# EAGLE design RCS_Metro_Telem_Board (EAGLE 8.7.1)
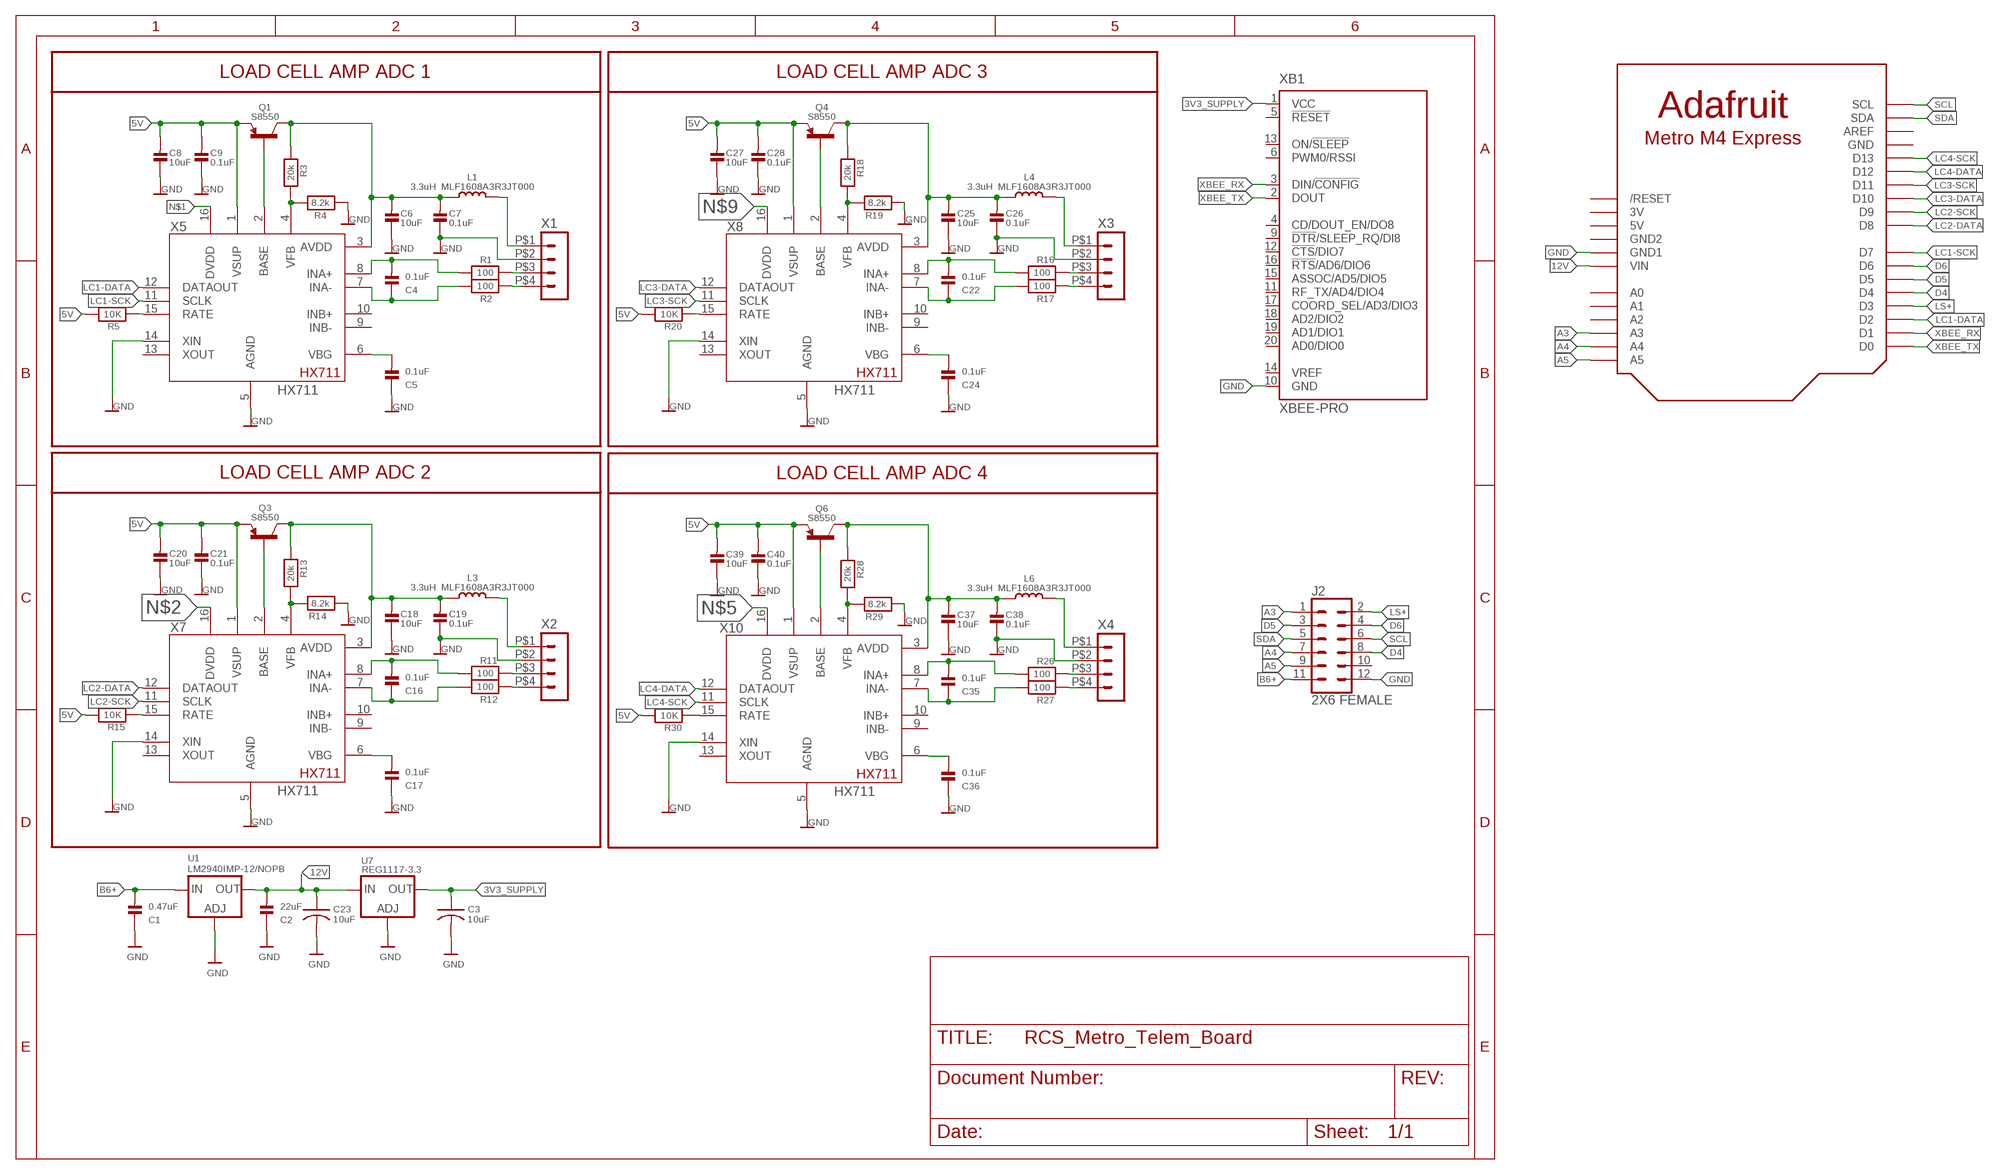
[diagram p0: schematic, sheet 1]

## Parts
C1  0.47uF  CAP_CERAMIC0603  [0603@1]
C2  22uF  CAP_CERAMIC0603  [0603@1]
C3  10uF  C-USC0603  [C0603]
C4  0.1uF  CAP_CERAMIC0603  [0603@1]
C5  0.1uF  CAP_CERAMIC0603  [0603@1]
C6  10uF  CAP_CERAMIC0603  [0603@1]
C7  0.1uF  CAP_CERAMIC0603  [0603@1]
C8  10uF  CAP_CERAMIC0603  [0603@1]
C9  0.1uF  CAP_CERAMIC0603  [0603@1]
C16  0.1uF  CAP_CERAMIC0603  [0603@1]
C17  0.1uF  CAP_CERAMIC0603  [0603@1]
C18  10uF  CAP_CERAMIC0603  [0603@1]
C19  0.1uF  CAP_CERAMIC0603  [0603@1]
C20  10uF  CAP_CERAMIC0603  [0603@1]
C21  0.1uF  CAP_CERAMIC0603  [0603@1]
C22  0.1uF  CAP_CERAMIC0603  [0603@1]
C23  10uF  C-USC0603  [C0603]
C24  0.1uF  CAP_CERAMIC0603  [0603@1]
C25  10uF  CAP_CERAMIC0603  [0603@1]
C26  0.1uF  CAP_CERAMIC0603  [0603@1]
C27  10uF  CAP_CERAMIC0603  [0603@1]
C28  0.1uF  CAP_CERAMIC0603  [0603@1]
C35  0.1uF  CAP_CERAMIC0603  [0603@1]
C36  0.1uF  CAP_CERAMIC0603  [0603@1]
C37  10uF  CAP_CERAMIC0603  [0603@1]
C38  0.1uF  CAP_CERAMIC0603  [0603@1]
C39  10uF  CAP_CERAMIC0603  [0603@1]
C40  0.1uF  CAP_CERAMIC0603  [0603@1]
J2  2X6 FEMALE  CONN_06X2PTH_FEMALE  [2X6]
L1  3.3uH MLF1608A3R3JT000  INDUCTOR0603_NO  [0603-NO]
L3  3.3uH MLF1608A3R3JT000  INDUCTOR0603_NO  [0603-NO]
L4  3.3uH MLF1608A3R3JT000  INDUCTOR0603_NO  [0603-NO]
L6  3.3uH MLF1608A3R3JT000  INDUCTOR0603_NO  [0603-NO]
Q1  S8550  TRANSISTOR_PNPWIDE  [SOT23-WIDE]
Q3  S8550  TRANSISTOR_PNPWIDE  [SOT23-WIDE]
Q4  S8550  TRANSISTOR_PNPWIDE  [SOT23-WIDE]
Q6  S8550  TRANSISTOR_PNPWIDE  [SOT23-WIDE]
R1  100  RESISTOR0603  [0603@1]
R2  100  RESISTOR0603  [0603@1]
R3  20k  RESISTOR0603  [0603@1]
R4  8.2k  RESISTOR0603  [0603@1]
R5  10K  RESISTOR0603  [0603@1]
R11  100  RESISTOR0603  [0603@1]
R12  100  RESISTOR0603  [0603@1]
R13  20k  RESISTOR0603  [0603@1]
R14  8.2k  RESISTOR0603  [0603@1]
R15  10K  RESISTOR0603  [0603@1]
R16  100  RESISTOR0603  [0603@1]
R17  100  RESISTOR0603  [0603@1]
R18  20k  RESISTOR0603  [0603@1]
R19  8.2k  RESISTOR0603  [0603@1]
R20  10K  RESISTOR0603  [0603@1]
R26  100  RESISTOR0603  [0603@1]
R27  100  RESISTOR0603  [0603@1]
R28  20k  RESISTOR0603  [0603@1]
R29  8.2k  RESISTOR0603  [0603@1]
R30  10K  RESISTOR0603  [0603@1]
U1  LM2940IMP-12/NOPB  LM1117SOT223-REFLOW  [SOT223-R]
U7  REG1117-3.3  LM1117SOT223-REFLOW  [SOT223-R]
U$1  ADAFRUIT_METRO_M4_EXPRESS  [ADAFRUIT_METRO_M4_EXPRESS]
X1  HEADER_POS4_43650-0415  [43650-0415]
X2  HEADER_POS4_43650-0415  [43650-0415]
X3  HEADER_POS4_43650-0415  [43650-0415]
X4  HEADER_POS4_43650-0415  [43650-0415]
X5  HX711  [SO16]
X7  HX711  [SO16]
X8  HX711  [SO16]
X10  HX711  [SO16]
XB1  XBEE-PRO  [XBEE-PRO]

## Nets
3V3_SUPPLY: C3.1 U7.2(OUT) XB1.1(VCC)
5V: C8.2 C9.2 C20.2 C21.2 C27.2 C28.2 C39.2 C40.2 Q1.2(E) Q3.2(E) Q4.2(E) Q6.2(E) R5.1 R15.1 R20.1 R30.1 X5.1(VSUP) X7.1(VSUP) X8.1(VSUP) X10.1(VSUP)
12V: C2.2 C23.1 U1.2(OUT) U7.3(IN) U$1.VIN
A3: J2.1 U$1.A3
A4: J2.7 U$1.A4
A5: J2.9 U$1.A5
B6+: C1.2 J2.11 U1.3(IN)
D4: J2.8 U$1.D4
D5: J2.3 U$1.D5
D6: J2.4 U$1.D6
GND [T1_OUT]: C1.1 C2.1 C3.2 C5.1 C6.1 C7.1 C8.1 C9.1 C17.1 C18.1 C19.1 C20.1 C21.1 C23.2 C24.1 C25.1 C26.1 C27.1 C28.1 C36.1 C37.1 C38.1 C39.1 C40.1 J2.12 R4.1 R14.1 R19.1 R29.1 U1.1(ADJ) U7.1(ADJ) U$1.GND1 X1.P$2 X2.P$2 X3.P$2 X4.P$2 X5.5(AGND) X5.14(XIN) X7.5(AGND) X7.14(XIN) X8.5(AGND) X8.14(XIN) X10.5(AGND) X10.14(XIN) XB1.10(GND)
LC1-DATA: U$1.D2 X5.12(DATAOUT)
LC1-SCK: U$1.D7 X5.11(SCLK)
LC2-DATA: U$1.D8 X7.12(DATAOUT)
LC2-SCK: U$1.D9 X7.11(SCLK)
LC3-DATA: U$1.D10 X8.12(DATAOUT)
LC3-SCK: U$1.D11 X8.11(SCLK)
LC4-DATA: U$1.D12 X10.12(DATAOUT)
LC4-SCK: U$1.D13 X10.11(SCLK)
LS+: J2.2 U$1.D3
N$1: X5.16(DVDD)
N$2: X7.16(DVDD)
N$3: R1.2 X1.P$3
N$4: R2.2 X1.P$4
N$5: X10.16(DVDD)
N$6: C4.1 R2.1 X5.7(INA-)
N$7: C4.2 R1.1 X5.8(INA+)
N$8: C5.2 X5.6(VBG)
N$9: X8.16(DVDD)
N$10: L1.2 X1.P$1
N$11: R3.1 R4.2 X5.4(VFB)
N$12: Q1.1(B) X5.2(BASE)
N$13: C6.2 C7.2 L1.1 Q1.3(C) R3.2 X5.3(AVDD)
N$14: R5.2 X5.15(RATE)
N$23: R11.2 X2.P$3
N$24: R12.2 X2.P$4
N$25: C16.1 R12.1 X7.7(INA-)
N$26: C16.2 R11.1 X7.8(INA+)
N$27: C17.2 X7.6(VBG)
N$28: L3.2 X2.P$1
N$29: R13.1 R14.2 X7.4(VFB)
N$30: Q3.1(B) X7.2(BASE)
N$31: C18.2 C19.2 L3.1 Q3.3(C) R13.2 X7.3(AVDD)
N$32: R15.2 X7.15(RATE)
N$33: R16.2 X3.P$3
N$34: R17.2 X3.P$4
N$35: C22.1 R17.1 X8.7(INA-)
N$36: C22.2 R16.1 X8.8(INA+)
N$37: C24.2 X8.6(VBG)
N$38: L4.2 X3.P$1
N$39: R18.1 R19.2 X8.4(VFB)
N$40: Q4.1(B) X8.2(BASE)
N$41: C25.2 C26.2 L4.1 Q4.3(C) R18.2 X8.3(AVDD)
N$42: R20.2 X8.15(RATE)
N$53: R26.2 X4.P$3
N$54: R27.2 X4.P$4
N$55: C35.1 R27.1 X10.7(INA-)
N$56: C35.2 R26.1 X10.8(INA+)
N$57: C36.2 X10.6(VBG)
N$58: L6.2 X4.P$1
N$59: R28.1 R29.2 X10.4(VFB)
N$60: Q6.1(B) X10.2(BASE)
N$61: C37.2 C38.2 L6.1 Q6.3(C) R28.2 X10.3(AVDD)
N$62: R30.2 X10.15(RATE)
SCL: J2.6 U$1.SCL
SDA: J2.5 U$1.SDA
XBEE_RX: U$1.D1 XB1.3(DIN/!CONFIG)
XBEE_TX: U$1.D0 XB1.2(DOUT)
Unconnected: J2.10 U$1.A0 U$1.A1 U$1.A2 U$1.AREF U$1.RESET(/RESET) X5.9(INB-) X5.10(INB+) X5.13(XOUT) X7.9(INB-) X7.10(INB+) X7.13(XOUT) X8.9(INB-) X8.10(INB+) X8.13(XOUT) X10.9(INB-) X10.10(INB+) X10.13(XOUT) XB1.4(CD/DOUT_EN/DO8) XB1.5(!RESET) XB1.6(PWM0/RSSI) XB1.9(!DTR!/SLEEP_RQ/DI8) XB1.11(RF_TX/AD4/DIO4) XB1.12(!CTS!/DIO7) XB1.13(ON/!SLEEP) XB1.14(VREF) XB1.15(ASSOC/AD5/DIO5) XB1.16(!RTS!/AD6/DIO6) XB1.17(COORD_SEL/AD3/DIO3) XB1.18(AD2/DIO2) XB1.19(AD1/DIO1) XB1.20(AD0/DIO0)

## Notes on the sheet
- LOAD CELL AMP ADC 1 | LOAD CELL AMP ADC 3
- LOAD CELL AMP ADC 2 | LOAD CELL AMP ADC 4

## Power pins joined to a net without a drawn wire
3V: U$1.3V
5V: U$1.5V
GND: U$1.GND
GND2: U$1.GND2

## Library data of the parts
C1 C2 C4-C9 C16-C22 C24-C28 C35-C40 = microbuilder:CAP_CERAMIC: Ceramic Capacitors 0402 - 0402 Surface Mount Capacitors 16pF 50V 5% [Digikey: 445-4899-2-ND] 18pF 50V 5% [Digikey: 490-1281-2-ND] 22pF 50V 5% [Digikey: 490-1283-2-ND] 68pF 50V 5% [Digikey: 490-1289-2-ND] 0.1uF 10V 10% [Digikey: 490-1318-2-ND] 1.0uF 6.3V 10% [Digikey: 490-1320-2-ND] 0603 - 0603 Surface Mount Capacitors 16 pF 50V 5% [Digikey: 445-5051-2-ND] 22 pF 50V [Digikey: PCC220ACVTR-ND] 33 pF 50V 5% [Digikey: 490-1415-1-ND] 56pF 50V 5% [Digikey: 490-1421-1-ND] 220pF 50V 5% [Digikey: 445-1285-1-ND] 680 pF 50V 2200 pF 50V 5% C0G [Digikey: 445-1297-1-ND] 5600 pF 100V 5% X7R [Digikey: 478-3711-1-ND] 0.1 µF 25V 10% [Digikey: PCC2277TR-ND] 0.22 µF 16V 10% X7R [Digikey: 445-1318-1-ND] 1.0 µF 25V 10% [Digikey: 445-5146-2-ND] 0603 - RF Specific 3pF 250V +/-0.1pF RF [Digikey: 712-1347-1-ND] 18 pF 250V 5% [Digikey: 478-3505-1-ND or 712-1322-1-ND] 56 pF 250V 5% C0G RF [Digikey: 490-4867-1-ND] 68 pF 250V RF [Digikey: 490-4868-1-ND] 0805 - 0805 Surface Mount Capacitors 220 pF 250V 2% RF Ceramic Capacitor [Digikey: 712-1398-1-ND] 1000 pF 50V 2% NP0 Ceramic Capacitor [Digikey: 478-3760-1-ND] 0.1 µF 25V 10% Ceramic Capacitor [Digikey: PCC1828TR-ND] 1.0 µF 16V 10% Ceramic Capacitor[Digikey: 490-1691-2-ND] 10.0 µF 10V 10% Ceramic Capacitor[Digikey: 709-1228-1-ND] 10.0 uF 16V 10% Ceramic Capacitor [Digikey: 478-5165-2-ND] 47 uF 6.3V 20% Ceramic Capacitor [Digikey: 587-1779-1-ND or 399-5506-1-ND] 1206 - 1206 Surface Mount Capacitors 47uF 10V 20% Ceramic Capacitor [Digikey: 490-5528-1-ND or 399-5508-1-ND or 445-6010-1-ND]
C3 C23 = adafruit:C-US: CAPACITOR, American symbol
J2 = SparkFun-Connectors:CONN_06X2: Multi connection point. Often used as Generic Header-pin footprint for 0.1 inch spaced/style header connections On any of the 0.1 inch spaced packages, you can populate with these: Break Away Headers - Straight <https://www.sparkfun.com/products/116> (PRT-00116) Break Away Male Headers - Right Angle <https://www.sparkfun.com/products/553> (PRT-00553) Female Headers <https://www.sparkfun.com/products/115> (PRT-00115) Break Away Headers - Machine Pin <https://www.sparkfun.com/products/117> (PRT-00117) Break Away Female Headers - Swiss Machine Pin <https://www.sparkfun.com/products/743> (PRT-00743); PROD_ID: CONN-12423
L1 L3 L4 L6 = microbuilder:INDUCTOR: Inductors 0603: 10nH Ceramic Inductor - microwire antenna/RF (Digikey: 712-1434-2-ND) 0805: 560nH Ceramic Inductor - RF (Digikey: 553-1047-1-ND) 270nH Ceramic Inductor - Q = 40@250MHz, +-5%, 1 Ohm DC Resistance (Digikey: 535-10506-2-ND) 1007 (2518 Metric) SMT: 10µH 10% 250mOhm 820mA 1007 Inductor (Digikey: 587-2189-1-ND) 22µH 10% 500mOhm 580mA 1007 Inductor (Digikey: 587-2190-1-ND) 47µH 10% 950mOhm 420mA 1007 Inductor (Digikey: 587-2191-1-ND) 47µH 5% 100mOhm 1A 1008 Inductor (Digikey: 732-1816-1-ND) 5.0x5.0mm (Taiyo Yuden NR5040 Series) 6.8µH 20% 2.3A 64mOhm Inductor (Digikey: 587-2374-2-ND) 5.0x5.0mm (TDK VLC5045 Series) 4.7µH 20% 3.3A 34mOhm Inductor (Digikey: 445-6526-1-ND) 6.8µH 20% 2.7A 46mOhm Inductor (Digikey: 445-6527-1-ND) 6.0x6.0mm (TDK VLC6045 Series) 4.7µH 20% 3.8A 27mOhm Inductor (Digikey: 445-6538-2-ND) 6.8µH 20% 3A 41mOhm Inductor (Digikey: 445-6540-1-ND) 6.2µH 30% 2.2A 45mOhm Inductor (Digikey: SRR5028-6R2YCT-ND) - Not TDK VLC6045 but footprint should match 6.0x6.0mm (TDK SLF6045 Series) 6.8uH 30% 2A 33mOhm Inductor (Digikey: 445-4572-1-ND, Mouser: 810-SLF645T6R8N2R0PF) 6.0x6.0mm (Sumida CDRH5D28 Series) 6.2uH 30% 1.8A 45mOhm Inductor (Digikey: 308-1542-1-ND) Taiyo Yuden NR3015T2R2M - 2.2uH 20% 1.5A (Digikey: 587-1648-2-ND, Mouser: 963-NR3015T2R2M) - Used with TI TPS62172 CoilCraft RFID Transponder Coil - MA5532-AE (For use with AS3935 Lightning Sensor) Taiyo Yuden NRH2412T2R2MNGH - 2.2uH 20% 1AA (Digikey: 587-3443-1-ND) - Used with TI LM3671 Vishay IHLP 1.0uH Molded Inductor - 24mOhm DCR, 5A, +/-20%, -55°C-125°C (Digikey: 541-1319-1-ND)
Q1 Q3 Q4 Q6 = microbuilder:TRANSISTOR_PNP: PNP Transistor Transistor (PNP) 800mA 60V, 1.6V VCE @ 500mA [Digikey: MMBT2907AFSTR-ND] Transistor (PNP) Low Sat - 1.5A 20V, 260mV VCE @ 400mA [Digikey: ZXTP25020DFLTR-ND] SOT23-R - SOT23 footprint optimised for use with solder paste and reflow ovens. SOT23-W - SOT23 footprint optimised for hand-soldering (larger pads).
R1-R5 R11-R20 R26-R30 = microbuilder:RESISTOR: Resistors 0402 - 0402 Surface Mount Package 22 Ohm 1% 1/16W [Digikey: 311-22.0LRTR-ND] 33 Ohm 5% 1/16W 1.0K 5% 1/16W 1.5K 5% 1/16W 2.0K 1% 1/16W 10.0K 1% 1/16W [Digikey: 311-10.0KLRTR-ND] 10.0K 5% 1/16W [Digikey: RMCF0402JT10K0TR-ND] 12.1K 1% 1/16W [Digikey: 311-22.0LRTR-ND] 100.0K 5% 1/16W 0603 - 0603 Surface Mount Package 0 Ohm 1/10 Watt 1% Resistor 15 Ohm 1/10 Watt 1% Resistor 33 Ohm 1/10 Watt 1% Resistor 49.9 Ohm 1/10 Watt 1% Resistor 100 Ohm 1/10 Watt 1% Resistor 150 Ohm 1/10 Watt 1% Resistor 240 Ohm 1/10 Watt 1% Resistor 390 Ohm 1/10 Watt 1% Resistor 560 Ohm 1/10 Watt 1% Resistor 680 Ohm 1/10 Watt 1% Resistor 750 Ohm 1/10 Watt 1% Resistor 1.0K Ohm 1/10 Watt 1% Resistor 1.5K Ohm 1/10 Watt 1% Resistor 2.0K Ohm 1/10 Watt 1% Resistor 2.2K Ohm 1/10 Watt 1% Resistor 3.3K Ohm 1/10 Watt 1% Resistor 4.7K Ohm 1/10 Watt 1% Resistor 10.0K Ohm 1/10 Watt 1% Resistor 12.0K Ohm 1/10 Watt 1% Resistor 12.1K Ohm 1/10 Watt 1% Resistor 20.0K Ohm 1/10 Watt 1% Resistor 33.0K Ohm 1/10 Watt 1% Resistor 100.0K Ohm 1/10 Watt 1% Resistor 0805 - 0805 Surface Mount Package 0 Ohm 1/8 Watt 1% Resistor 33 Ohm 1/8 Watt 1% Resistor 100 Ohm 1/8 Watt 1% Resistor 150 Ohm 1/8 Watt 1% Resistor 200 Ohm 1/8 Watt 1% Resistor 240 Ohm 1/8 Watt 1% Resistor 330 Ohm 1/8 Watt 1% Resistor 390 Ohm 1/8 Watt 1% Resistor 470 Ohm 1/8 Watt 1% Resistor 1.0K Ohm 1/8 Watt 1% Resistor 1.5K Ohm 1/8 Watt 1% Resistor 2.0K Ohm 1/8 Watt 1% Resistor 4.7K Ohm 1/8 Watt 1% Resistor 5.1K Ohm 1/8 Watt 1% Resistor 5.6K Ohm 1/8 Watt 1% Resistor 10.0K Ohm 1/8 Watt 1% Resistor 22.0K Ohm 1/8 Watt 1% Resistor 33.0K Ohm 1/8 Watt 1% Resistor 100K Ohm 1/8 Watt 1% Resistor 1206 - 1206 Surface Mount Package 2012 - 2010 Surface Mount Package 0.11 Ohm 1/2 Watt 1% Resistor - Digikey: RHM.11UCT-ND
U1 U7 = microbuilder:LM1117: LM1117 Voltage Regulator LM1117 Adjustable Voltage regulator [Digikey: LM1117IMP-ADJDKR-ND] LM1117 3.3V Voltage regulator [AP1117E33GDIDKR-ND] LM1117 5.0V Voltage regulator [AP1117E50GDIDKR-ND] SOT223-REFLOW - SOT223 package for solder paste/reflow ovens SOT223-WAVE - SOT223 package for hand-soldering (larger pads) Note: For the fixed-voltage regulators, simply set the ADJ pin to GND.
U$1 = Shawn'sCustomComponents:ADAFRUIT_METRO_M4_EXPRESS
X1-X4 = con-molex-micro-fit-3_0:HEADER_POS4_?: Molex - Micro-Fit 3.0 Series connector, 3.00mm (0.118") pitch header, 4 positions.
X5 X7 X8 X10 = adafruit_sensor:HX711
XB1 = maxstream:XBEE: XBee (TM) /XBee-PRO(TM) OEM RF Modules Source: MaxStream, Inc. xbee_productmanual.pdf; MPN: XBP24-AWI-001; OC_FARNELL: 1337916; OC_NEWARK: 42M2667

## Net classes
1 highpower: width 0.254 mm, drill 0.483 mm

## Board
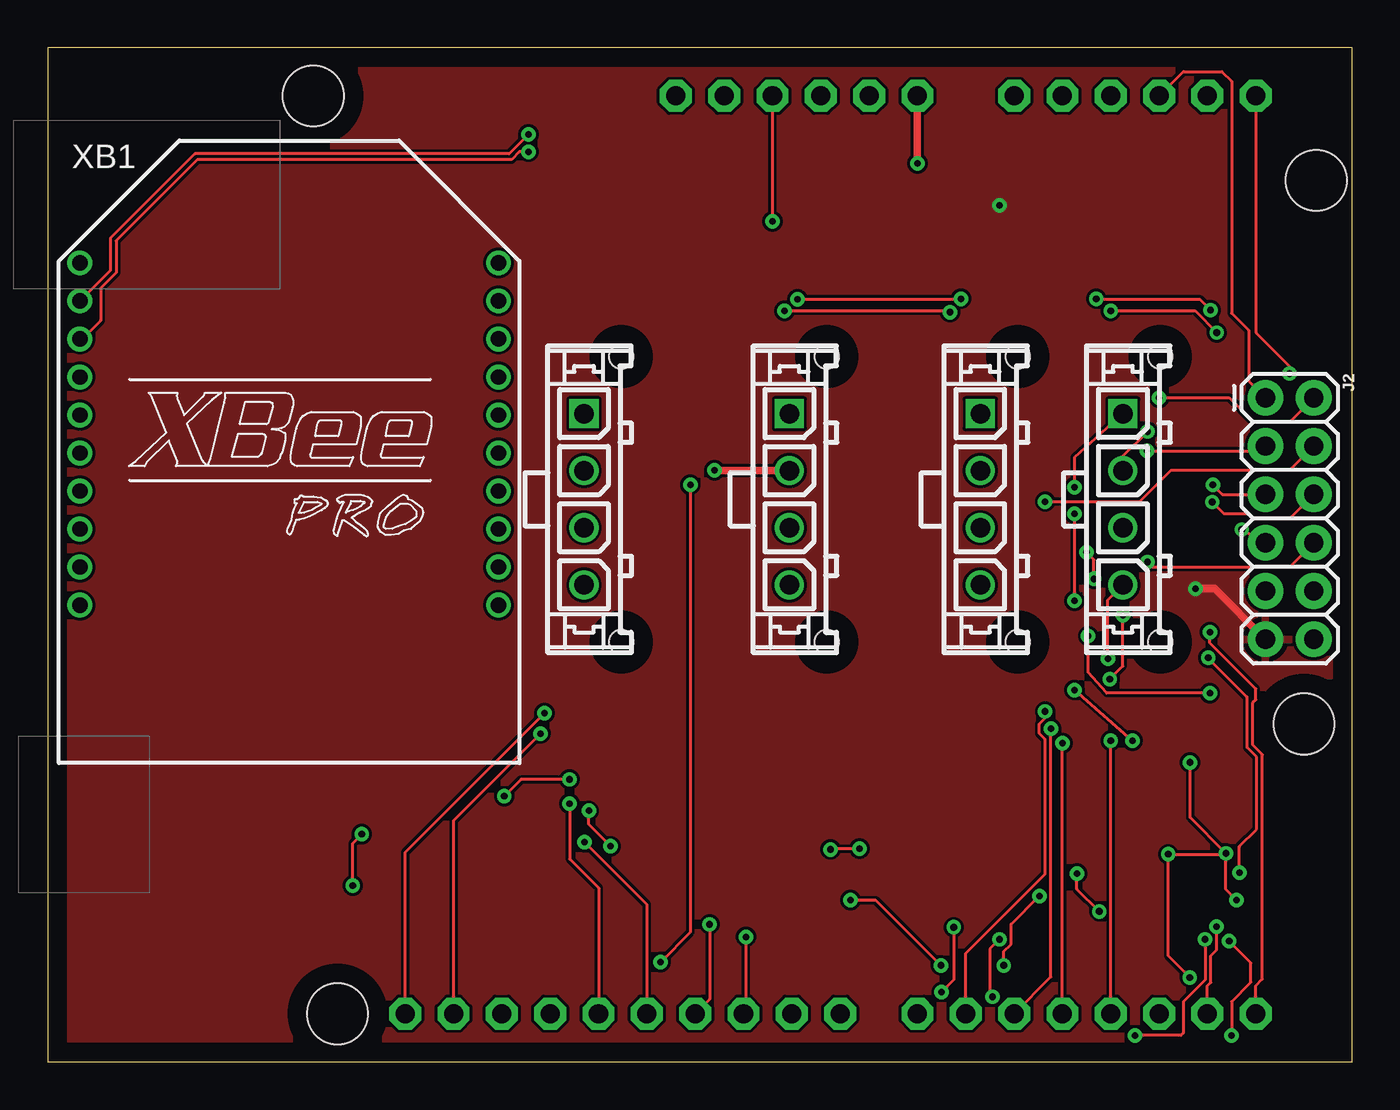
[diagram p1: board, top side]
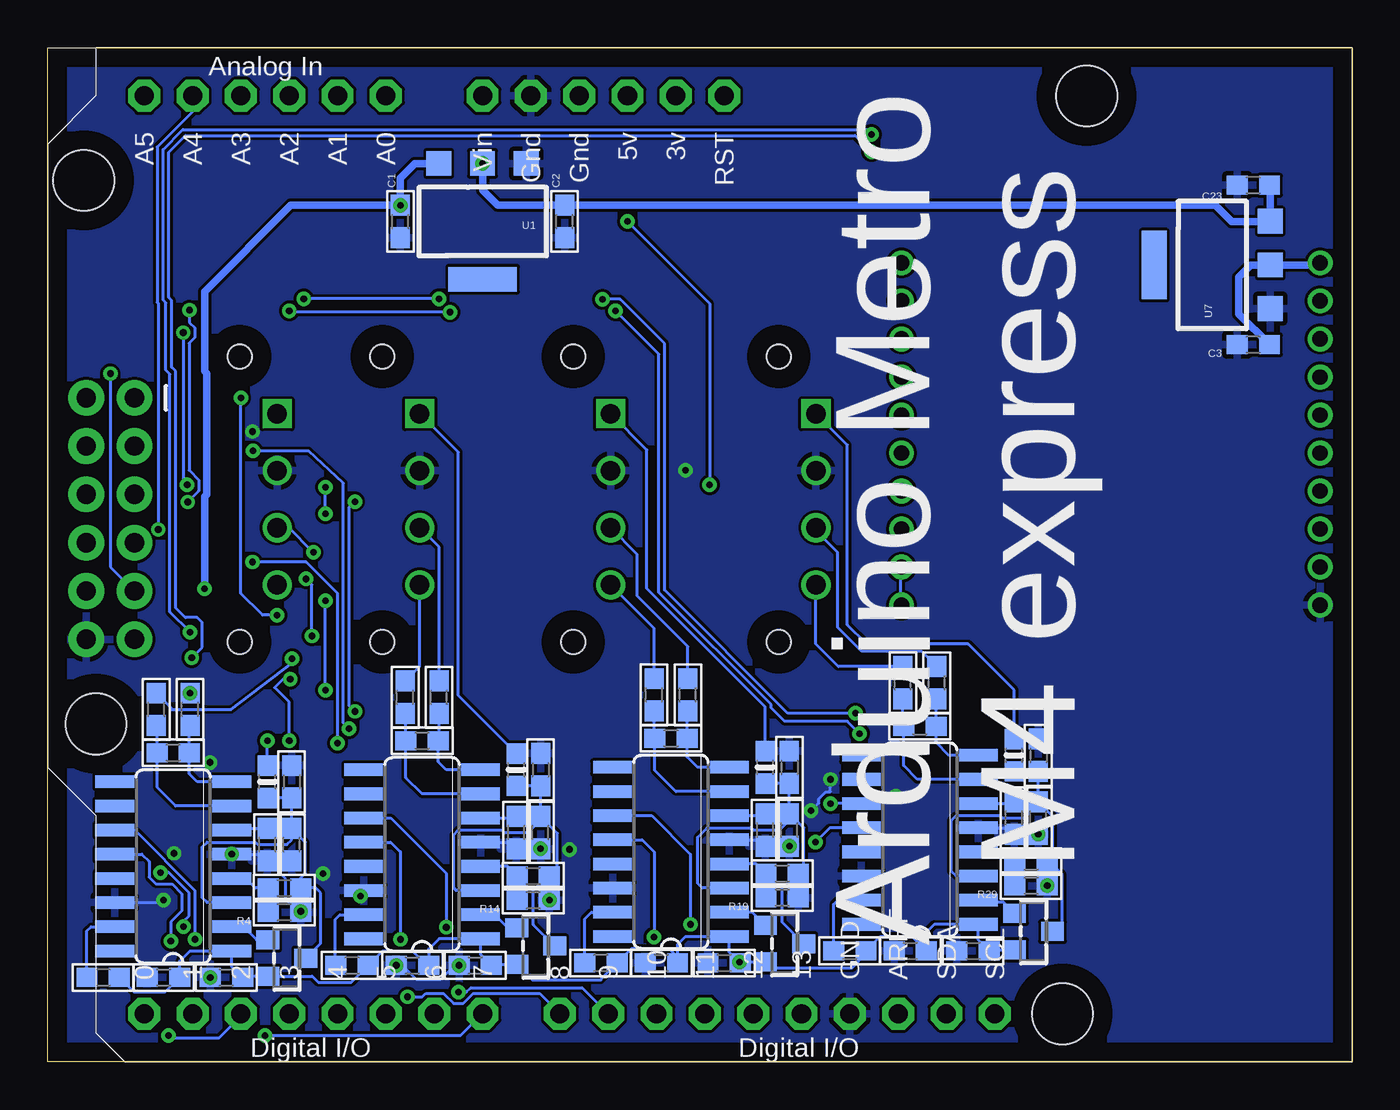
[diagram p2: board, bottom side, seen from below]

Size 68.58 x 53.34 mm. Coordinates in mm from the lower left corner, seen from the top.
Outline: 0,0 68.58,0 68.58,53.34 0,53.34 0,0
Copper layers (1*16): Top 0.035mm / dielectric 1.5mm / Bottom 0.035mm
Design rules "default": minimum track width 6mil, minimum drill 0.35mm, track to track 6mil, track to pad 6mil, pad to pad 6mil, via to via 6mil, smd to smd 6mil, copper to edge 40mil, drill to drill 6mil, minimum pad ring 10mil, minimum via ring 8mil, stop-mask expansion 4mil, vias tented up to drill 0mil, thermal gap 10mil

### Footprints (pad centres in the part's own frame; a part is rotated, then mirrored left to right if it is on the bottom)
0603@1 = smd 1.1 x 1: 1 -0.85,0; 2 0.85,0
C0603 = smd 1.1 x 1: 1 -0.85,0; 2 0.85,0
2X6 = drill 1.016 pad 1.88: 1 0,0; 2 0,2.54; 3 2.54,0; 4 2.54,2.54; 5 5.08,0; 6 5.08,2.54; 7 7.62,0; 8 7.62,2.54; 9 10.16,0; 10 10.16,2.54; 11 12.7,0; 12 12.7,2.54
0603-NO = smd 1.075 x 1: 1 -0.85,0; 2 0.85,0
SOT23-WIDE = smd 1 x 1.2: 1 -0.95,-1; 2 0.95,-1; 3 0,1
SOT223-R = smd 1.3 x 1.3: 1 -2.3,-3.05; 2 0,-3.05; 3 2.3,-3.05 | smd 3.6 x 1.3: 4 0,3.05
ADAFRUIT_METRO_M4_EXPRESS = drill 1 pad 1.676 octagon: 3V 35.56,2.54; 5V 38.1,2.54; A0 50.8,2.54; A1 53.34,2.54; A2 55.88,2.54; A3 58.42,2.54; A4 60.96,2.54; A5 63.5,2.54; AREF 23.876,50.8; D0 63.5,50.8; D1 60.96,50.8; D2 58.42,50.8; D3 55.88,50.8; D4 53.34,50.8; D5 50.8,50.8; D6 48.26,50.8; D7 45.72,50.8; D8 41.656,50.8; D9 39.116,50.8; D10 36.576,50.8; D11 34.036,50.8; D12 31.496,50.8; D13 28.956,50.8; GND 26.416,50.8; GND1 43.18,2.54; GND2 40.64,2.54; RESET 33.02,2.54; SCL 18.796,50.8; SDA 21.336,50.8; VIN 45.72,2.54 | hole 3.2: 15.24,50.8; 66.04,35.56; 13.97,2.54; 66.675,6.985
43650-0415 = drill 1.02 square: P$1 4.5,0 | drill 1.02: P$2 1.5,0; P$3 -1.5,0; P$4 -4.5,0 | hole 1.27: 7.5,-1.96; -7.5,-1.96
SO16 = smd 0.66 x 2.032: 1 -4.445,-3.073; 2 -3.175,-3.073; 3 -1.905,-3.073; 4 -0.635,-3.073; 5 0.635,-3.073; 6 1.905,-3.073; 7 3.175,-3.073; 8 4.445,-3.073; 9 4.445,3.073; 10 3.175,3.073; 11 1.905,3.073; 12 0.635,3.073; 13 -0.635,3.073; 14 -1.905,3.073; 15 -3.175,3.073; 16 -4.445,3.073
XBEE-PRO = drill 0.8 pad 1.27: 1 -11,9; 2 -11,7; 3 -11,5; 4 -11,3; 5 -11,1; 6 -11,-1; 7 -11,-3; 8 -11,-5; 9 -11,-7; 10 -11,-9; 11 11,-9; 12 11,-7; 13 11,-5; 14 11,-3; 15 11,-1; 16 11,1; 17 11,3; 18 11,5; 19 11,7; 20 11,9

### Placement (x,y rotation side)
C1  50.04,44.2 90 bottom
C2  41.4,44.2 90 bottom
C3  5.21,37.72 180 bottom
C4  61.98,16.26 0 bottom
C5  57.02,11.43 90 bottom
C6  55.75,14.73 270 bottom
C7  55.75,11.43 90 bottom
C8  59.18,4.45 0 bottom
C9  62.48,4.45 0 bottom
C16  48.9,16.89 0 bottom
C17  43.94,12.06 90 bottom
C18  42.67,15.37 270 bottom
C19  42.67,12.06 90 bottom
C20  46.1,5.08 0 bottom
C21  49.4,5.08 0 bottom
C22  35.81,17.02 0 bottom
C23  5.21,46.1 180 bottom
C24  30.86,12.19 90 bottom
C25  29.59,15.49 270 bottom
C26  29.59,12.19 90 bottom
C27  33.02,5.21 0 bottom
C28  36.32,5.21 0 bottom
C35  22.73,17.65 0 bottom
C36  17.78,12.83 90 bottom
C37  16.51,16.13 270 bottom
C38  16.51,12.83 90 bottom
C39  19.94,5.84 0 bottom
C40  23.24,5.84 0 bottom
J2  64.01,34.92 270 top
L1  57.02,14.73 90 bottom
L3  43.94,15.37 90 bottom
L4  30.86,15.49 90 bottom
L6  17.78,16.13 90 bottom
Q1  56.01,5.46 270 bottom
Q3  42.93,6.1 270 bottom
Q4  29.84,6.22 270 bottom
Q6  16.76,6.86 270 bottom
R1  61.09,18.54 90 bottom
R2  62.87,18.54 90 bottom
R3  56.13,9.14 0 bottom
R4  56.13,7.87 180 bottom
R5  65.66,4.45 180 bottom
R11  48.01,19.18 90 bottom
R12  49.78,19.18 90 bottom
R13  43.05,9.78 0 bottom
R14  43.05,8.51 180 bottom
R15  52.58,5.08 180 bottom
R16  34.92,19.3 90 bottom
R17  36.7,19.3 90 bottom
R18  29.97,9.91 0 bottom
R19  29.97,8.64 180 bottom
R20  39.5,5.21 180 bottom
R26  21.84,19.94 90 bottom
R27  23.62,19.94 90 bottom
R28  16.89,10.54 0 bottom
R29  16.89,9.27 180 bottom
R30  26.42,5.84 180 bottom
U1  45.72,44.2 180 bottom
U7  7.37,41.91 90 bottom
U$1  0,53.34 180 bottom
X1  56.52,29.59 90 top
X2  49.02,29.59 90 top
X3  38.99,29.59 90 top
X4  28.19,29.59 90 top
X5  61.98,10.29 90 bottom
X7  48.9,10.92 90 bottom
X8  35.81,11.05 90 bottom
X10  22.73,11.68 90 bottom
XB1  12.7,33.02 0 top

### Tracks (layer width: path | path; a pad name or v marks a point on that pad's centre or on a via)
3V3_SUPPLY
  Bottom 0.406: C3.1 5.97,39.33 5.97,41.27 5.33,41.91 U7.2 1.81,41.91 XB1.1
5V  (via drill 0.35)
  Top 0.152: U$1.5V v38.1,44.2 | v33.78,30.35 33.78,6.82 v32.21,5.25
  Bottom 0.152: Q6.2 19.02,5.91 C39.2 19.66,6.41 X10.1 21.97,7.24 22.39,6.82 C40.2 23.15,6.6 24.8,6.6 R30.1 25.57,5.68 26.29,4.95 30.52,4.95 Q4.2 32.1,5.27 C27.2 v32.21,5.25 32.74,5.78 X8.1 35.05,6.6 35.47,6.18 C28.2 35.47,5.5 35.94,5.97 37.88,5.97 R20.1 39.5,4.36 39.5,4.32 43.1,4.32 Q3.2 45.19,5.15 C20.2 45.82,5.65 X7.1 48.01,6.48 48.55,5.93 C21.2 48.64,5.08 49.4,5.84 50.97,5.84 R15.1 52.62,4.19 54.36,4.19 54.68,4.51 Q1.2 58.27,4.51 C8.2 58.9,5.02 X5.1 61.09,5.84 61.63,5.29 C9.2 62.4,3.68 64.05,3.68 R5.1 | v38.1,44.2 33.78,39.88 v33.78,30.35
12V  (via drill 0.35)
  Top 0.406: U1.2 U$1.VIN
  Bottom 0.406: U1.2 45.72,45.85 44.92,45.05 C2.2 7.2,45.05 6.35,44.2 4.33,44.2 U7.3 4.32,46.06 C23.1
  other vias: 45.72,47.25
A3
  Top 0.152: U$1.A3 59.69,52.07 61.72,52.07 62.23,51.56 62.23,39.37 63.12,38.48 63.12,35.81 J2.1
A4  (via drill 0.35)
  Top 0.152: v62.76,28 J2.7
  Bottom 0.152: U$1.A4 60.96,49.96 62.82,48.1 62.82,39.94 62.76,39.88 v62.76,28
A5  (via drill 0.35)
  Top 0.152: U$1.A5 63.5,38.35 65.28,36.58 v65.28,36.2
  Bottom 0.152: v65.28,36.2 65.28,26.04 J2.9
B6+  (via drill 0.35)
  Top 0.406: J2.11 61.34,24.89 v60.33,24.89
  Bottom 0.406: U1.3 49.27,47.25 50.04,46.48 C1.2 55.79,45.05 60.33,40.51 60.33,36.32 60.2,36.2 60.2,29.84 60.33,29.72 v60.33,24.89
  other vias: 50.04,45.05
  pour Top: -2.54,-2.54 71.12,-2.54 71.12,55.88 -2.54,55.88
D4  (via drill 0.35)
  Top 0.152: U$1.D4 v53.34,16.76 | v57.81,26.29 58.07,26.04 65.28,26.04 J2.8
  Bottom 0.152: v53.34,16.76 53.34,24.64 54.99,26.29 v57.81,26.29
D5  (via drill 0.35)
  Top 0.152: U$1.D5 52.73,4.47 v52.73,17.53 | v57.78,32.13 63.75,32.13 J2.3
  Bottom 0.152: v52.73,17.53 53.03,17.83 53.03,30.43 54.86,32.13 v57.78,32.13
D6  (via drill 0.35)
  Top 0.152: U$1.D6 48.26,5.71 52.43,9.88 52.43,16.97 52.13,17.27 52.13,17.78 52.43,18.08 v52.43,18.43 | v52.43,29.46 57.4,29.46 59.05,31.11 65.28,31.11 J2.4
  Bottom 0.152: v52.43,18.43 52.73,18.74 52.73,29.16 v52.43,29.46
GND  (via drill 0.35)
  Top 0.152: v62.48,8.51 61.93,9.06 61.93,10.92 | 61.93,10.92 v61.93,10.97 60.05,12.85 v60.05,15.75 | X1.P$2 56.52,31.85 v57.81,33.15 | C21.1 50.25,5.81 50.65,6.2 50.65,7.24 v52.13,8.72 | v55.27,7.92 54.1,9.09 v54.1,9.91 | 61.93,10.92 X5.5 58.9,5.57 C8.1 | C19.1 41.19,11.21 v41.15,11.18 | C26.1 28.45,12.48 v28.45,13.21 | v27.43,14.86 24.89,14.86 v24,13.97 | R29.1 16.04,11.51 C38.1 | C20.1 43.52,8.51 R14.1
  Top 0.406: X3.P$2 35.08,31.09 v35.05,31.11
  Bottom 0.152: X5.5 57.37,10.92 C5.1 56.06,9.62 56.06,8.55 55.93,8.41 55.83,8.41 R4.1 55.27,7.88 v55.27,7.92 | X7.5 44.28,11.56 C17.1 C19.1 | C26.1 C24.1 31.2,11.68 X8.5 | X10.5 18.12,12.32 C36.1 C38.1 | X5.14 62.61,8.38 v62.48,8.51 | v52.13,8.72 51.97,8.88 X7.14 | v27.43,14.86 27.43,14.22 27.46,14.2 27.68,14.2 28.04,13.84 28.04,13.62 v28.45,13.21 | C21.1 49.93,5.08 49.2,4.35 47.91,4.35 47.18,5.08 C20.1
  other vias: 50.25,5.08 58.9,10.92 42.67,11.21 29.59,11.34 16.04,9.27 16.51,11.98 46.95,5.08 42.2,8.51 60.03,4.45
  pour Bottom: -5.08,-5.08 73.66,-5.08 73.66,58.42 -5.08,58.42
LC1-DATA  (via drill 0.35)
  Top 0.152: v62.23,1.39 62.23,3.17 63.25,4.19 63.25,5.21 v62.1,6.35
  Bottom 0.152: X5.12 63.63,10.92 63.25,10.54 63.25,9.71 62.89,9.36 62.04,9.36 61.52,8.84 61.52,7.95 62.1,7.37 v62.1,6.35 | v62.23,1.39 62.11,1.27 59.56,1.27 58.42,2.41 U$1.D2
LC1-SCK  (via drill 0.35)
  Top 0.152: v57.15,1.39 59.56,1.39 59.69,1.52 59.69,3.17 60.83,4.31 v60.83,6.45
  Bottom 0.152: X5.11 64.01,12.19 60.83,9.02 v60.83,6.45 | v57.15,1.39 46.87,1.39 U$1.D7
LC2-DATA  (via drill 0.35)
  Top 0.152: v50.04,6.45 49.53,5.94 49.53,3.56 v49.66,3.43
  Bottom 0.152: X7.12 50.55,11.56 50.04,11.05 v50.04,6.45 | v49.66,3.43 48.88,3.43 48.7,3.61 47.77,3.61 47.24,3.08 46.74,3.08 46.21,3.61 42.72,3.61 U$1.D8
LC2-SCK  (via drill 0.35)
  Top 0.152: v47.62,7.08 47.62,4.32 v46.99,3.68
  Bottom 0.152: X7.11 50.55,12.83 47.62,9.91 v47.62,7.08 | v46.99,3.68 46.56,3.68 46.33,3.91 40.49,3.91 U$1.D9
LC3-DATA  (via drill 0.35)
  Top 0.152: v36.7,6.58 36.7,2.67 U$1.D10
  Bottom 0.152: X8.12 37.34,11.68 36.7,11.05 v36.7,6.58
LC3-SCK  (via drill 0.35)
  Top 0.152: v34.8,7.24 34.8,3.3 U$1.D11
  Bottom 0.152: X8.11 36.83,12.95 34.8,10.92 v34.8,7.24
LC4-DATA  (via drill 0.35)
  Top 0.152: v28.22,11.56 31.5,8.28 U$1.D12
  Bottom 0.152: X10.12 27.46,12.32 v28.22,11.56
LC4-SCK  (via drill 0.35)
  Top 0.152: v27.43,13.59 27.43,10.67 28.96,9.14 U$1.D13
  Bottom 0.152: X10.11 v27.43,13.59
LS+  (via drill 0.35)
  Top 0.152: U$1.D3 v55.88,16.89 | J2.2 65.28,33.66 63.37,33.66 62.1,34.92 v58.42,34.92 | v55.82,20.13 56.52,20.82 v56.52,23.5
  Bottom 0.152: v58.42,34.92 58.42,24.64 57.28,23.5 v56.52,23.5 | v55.88,16.89 55.88,18.92 56.64,19.68 56.2,20.13 v55.82,20.13
N$3  (via drill 0.35)
  Top 0.152: v54.69,22.4 54.69,20.5 55.66,19.39 R1.2 | v54.99,25.4 54.99,26.42 v54.61,26.8
  Bottom 0.152: v54.61,26.8 55.9,28.09 X1.P$3 | v54.69,22.4 54.69,25.1 v54.99,25.4
  other vias: 61.09,19.39
N$4  (via drill 0.35)
  Top 0.152: v55.73,21.21 55.73,24.3 X1.P$4
  Bottom 0.152: R2.2 62.1,18.63 62.1,18.54 58.93,18.54 55.73,20.98 v55.73,21.21
N$6
  Bottom 0.152: X5.7 61.85,13.46 62.83,14.44 C4.1 62.83,17.65 R2.1
N$7
  Bottom 0.152: X5.8 60.71,14.73 61.13,15.15 C4.2 61.13,17.65 R1.1
N$8
  Bottom 0.152: X5.6 58.81,12.28 C5.2
N$10  (via drill 0.35)
  Top 0.152: v57.02,16.89 v53.98,19.56 | v53.98,30.23 53.98,31.8 X1.P$1 | v53.98,24.26 v53.98,28.83
  Bottom 0.152: L1.2 v57.02,16.89 | v53.98,28.83 v53.98,30.23 | v53.98,19.56 v53.98,24.26
N$11
  Bottom 0.152: R3.1 57.02,9.14 | 57.02,9.14 57.66,9.14 58.17,9.65 X5.4 | R4.2 56.98,9.11 57.02,9.14
N$12
  Bottom 0.152: Q1.1 57.59,6.41 58.29,7.11 X5.2
N$13
  Bottom 0.152: Q1.3 54.23,6.24 54.23,8.89 54.48,9.14 R3.2 55.28,9.68 55.02,9.94 55.02,11.55 C7.2 | X5.3 60.2,8.38 60.45,8.64 60.45,11.3 60.2,11.56 57.67,11.56 57.62,11.5 57.6,11.5 57.53,11.43 56.01,11.43 55.75,11.68 C7.2 | L1.1 C6.2 C7.2
N$14
  Bottom 0.152: R5.2 66.51,6.9 66.29,7.11 X5.15
N$15
  Bottom 0.152: 23.75,24 23.75,26.04
N$23
  Bottom 0.152: R11.2 48.01,27.07 X2.P$3
N$24
  Bottom 0.152: R12.2 49.02,20.79 X2.P$4
N$25
  Bottom 0.152: X7.7 48.9,14.1 49.74,14.95 C16.1 49.74,18.29 R12.1
N$26
  Bottom 0.152: X7.8 47.62,15.37 48.05,15.79 C16.2 48.01,16.93 R11.1
N$27
  Bottom 0.152: X7.6 44.03,12.83 C17.2
N$28
  Bottom 0.152: L3.2 46.99,19.27 46.99,32.06 X2.P$1
N$29
  Bottom 0.152: R14.2 R13.1 44.41,10.29 X7.4
N$30
  Bottom 0.152: Q3.1 44.38,7.05 45.09,7.75 X7.2
N$31
  Bottom 0.152: 42.63,12.87 41.78,12.03 41.78,10.2 R13.2 42.31,9.78 43.05,9.03 43.05,7.22 Q3.3 | 42.63,12.87 C19.2 C18.2 L3.1 | X7.3 47.12,9.02 47.24,9.14 47.24,11.94 46.99,12.19 44.7,12.19 44.58,12.06 43.31,12.06 42.63,12.74 42.63,12.87
N$32
  Bottom 0.152: R15.2 53.47,5.12 53.47,7.49 53.21,7.75 X7.15
N$33
  Bottom 0.152: R16.2 34.92,21.84 37.59,24.51 37.59,26.69 X3.P$3
N$34
  Bottom 0.152: R17.2 36.7,22.8 X3.P$4
N$35
  Bottom 0.152: X8.7 35.56,14.22 36.66,15.33 C22.1 36.7,17.06 R17.1
N$36
  Bottom 0.152: X8.8 34.42,15.49 34.96,16.04 C22.2 34.96,18.41 R16.1
N$37
  Bottom 0.152: X8.6 30.95,12.95 C24.2
N$38
  Bottom 0.152: L4.2 30.86,18.67 37.08,24.89 37.08,32.19 X3.P$1
N$39
  Bottom 0.152: R19.2 R18.1 31.33,10.41 X8.4
N$40
  Bottom 0.152: Q4.1 31.55,7.87 X8.2
N$41
  Bottom 0.152: C26.2 29.55,13.04 28.83,12.32 28.83,10.2 R18.2 29.23,9.91 29.9,9.23 29.9,9.21 29.97,9.14 29.97,7.35 Q4.3 | C26.2 C25.2 L4.1 | X8.3 34.16,9.14 34.42,9.4 34.42,11.81 33.91,12.32 31.62,12.32 31.5,12.19 30.1,12.19 29.59,12.7 C26.2
N$42
  Bottom 0.152: R20.2 40.35,7.53 40.01,7.87 X8.15
N$53
  Bottom 0.152: R26.2 22.64,21.59 25.78,21.59 27.05,22.86 27.05,26.8 28.19,27.94 X4.P$3
N$54
  Bottom 0.152: R27.2 27.01,20.79 28.19,21.97 X4.P$4
N$55
  Bottom 0.152: X10.7 22.86,14.86 23.58,15.58 C35.1 23.62,17.69 R27.1
N$56
  Bottom 0.152: X10.8 21.21,16.13 21.88,16.8 C35.2 21.88,19.05 R26.1
N$57
  Bottom 0.152: X10.6 17.87,13.59 C36.2
N$58
  Bottom 0.152: L6.2 17.78,19.56 20.19,21.97 25.53,21.97 26.54,22.99 26.54,32.44 X4.P$1
N$59
  Bottom 0.152: X10.4 18.25,11.05 17.76,10.56 | 17.76,10.56 R28.1 | R29.2 17.76,9.29 17.76,10.56
N$60
  Bottom 0.152: Q6.1 18.34,8.38 19.53,8.38 X10.2
N$61
  Bottom 0.152: Q6.3 15.26,7.36 15.26,9.87 15.94,10.54 R28.2 15.75,10.83 15.75,12.91 C38.2 | C38.2 16.51,13.72 C37.2 L6.1 | X10.3 20.83,9.78 21.08,10.03 21.08,12.7 20.83,12.95 18.54,12.95 18.41,12.83 17.26,12.83 16.51,13.57 C38.2
N$62
  Bottom 0.152: R30.2 27.27,8.29 27.05,8.51 X10.15
SCL  (via drill 0.35)
  Top 0.152: U$1.SCL 18.8,11.02 v26.11,18.34 | v61.13,39.54 60.56,40.1 55.15,40.1 v55.12,40.13 | v61.21,29.44 61.83,28.83 63.12,28.83 63.37,28.57 65.28,28.57 J2.6 | v39.41,40.1 47.98,40.1 v48.01,40.13
  Bottom 0.152: v26.11,18.34 29.67,18.34 36.14,24.81 36.14,37.76 38.48,40.1 v39.41,40.1 | v61.13,39.54 61.13,38.89 60.84,38.6 60.84,38.09 61.15,37.79 61.15,31.11 60.63,30.6 60.63,30.02 v61.21,29.44 | v48.01,40.13 v55.12,40.13
SDA  (via drill 0.35)
  Top 0.152: U$1.SDA 21.34,12.7 v25.91,17.27 | v61.45,38.35 60.31,39.5 v55.88,39.5 | v61.24,30.35 61.75,29.84 J2.5 | v38.73,39.5 47.36,39.5 v47.43,39.43
  Bottom 0.152: v25.91,17.27 26.54,17.91 29.84,17.91 30.56,18.62 30.56,18.8 36.45,24.69 36.45,37.21 v38.73,39.5 | v61.45,38.35 61.45,30.56 v61.24,30.35 | v47.43,39.43 55.81,39.43 v55.88,39.5
XBEE_RX  (via drill 0.35)
  Top 0.152: 63.04,19.18 63.04,16.54 63.55,16.03 63.55,12.24 62.64,11.33 v62.64,9.96 | 63.04,19.18 63.04,19.21 | v25.27,47.86 24.8,47.86 24.38,47.45 7.87,47.45 3.61,43.18 3.61,41.5 2.79,40.68 2.79,38.99 1.82,38.02 XB1.3 | U$1.D1 60.96,4.01 61.14,4.18 61.14,5.59 61.44,5.89 v61.44,7.13 | 63.04,19.18 61.13,21.09 v61,21.25
  Bottom 0.152: v25.27,47.86 26.13,48.72 61.34,48.72 62.21,47.85 62.21,40.19 62.06,40.04 62.06,36.53 61.85,36.32 61.85,23.88 61.34,23.37 60.71,23.37 60.45,23.11 60.45,21.8 v61,21.25 | v61.44,7.13 61.44,7.39 61.14,7.7 61.14,8.89 62.21,9.96 v62.64,9.96
XBEE_TX  (via drill 0.35)
  Top 0.152: U$1.D0 63.5,4.01 63.85,4.37 63.85,16.16 63.35,16.66 63.35,18.89 63.5,19.05 63.5,19.61 61.09,22.03 v61.09,22.61 | v25.27,48.77 24.26,47.75 7.75,47.75 3.3,43.31 3.3,41.62 XB1.2
  Bottom 0.152: v25.27,48.77 25.53,49.02 61.47,49.02 62.51,47.98 62.51,40.07 62.36,39.91 62.36,36.38 62.15,36.17 62.15,23.67 v61.09,22.61